# Altium schematic sheet FPGA_PWR.SchDoc
size A4; SheetNumber: 6; SheetTotal: 8
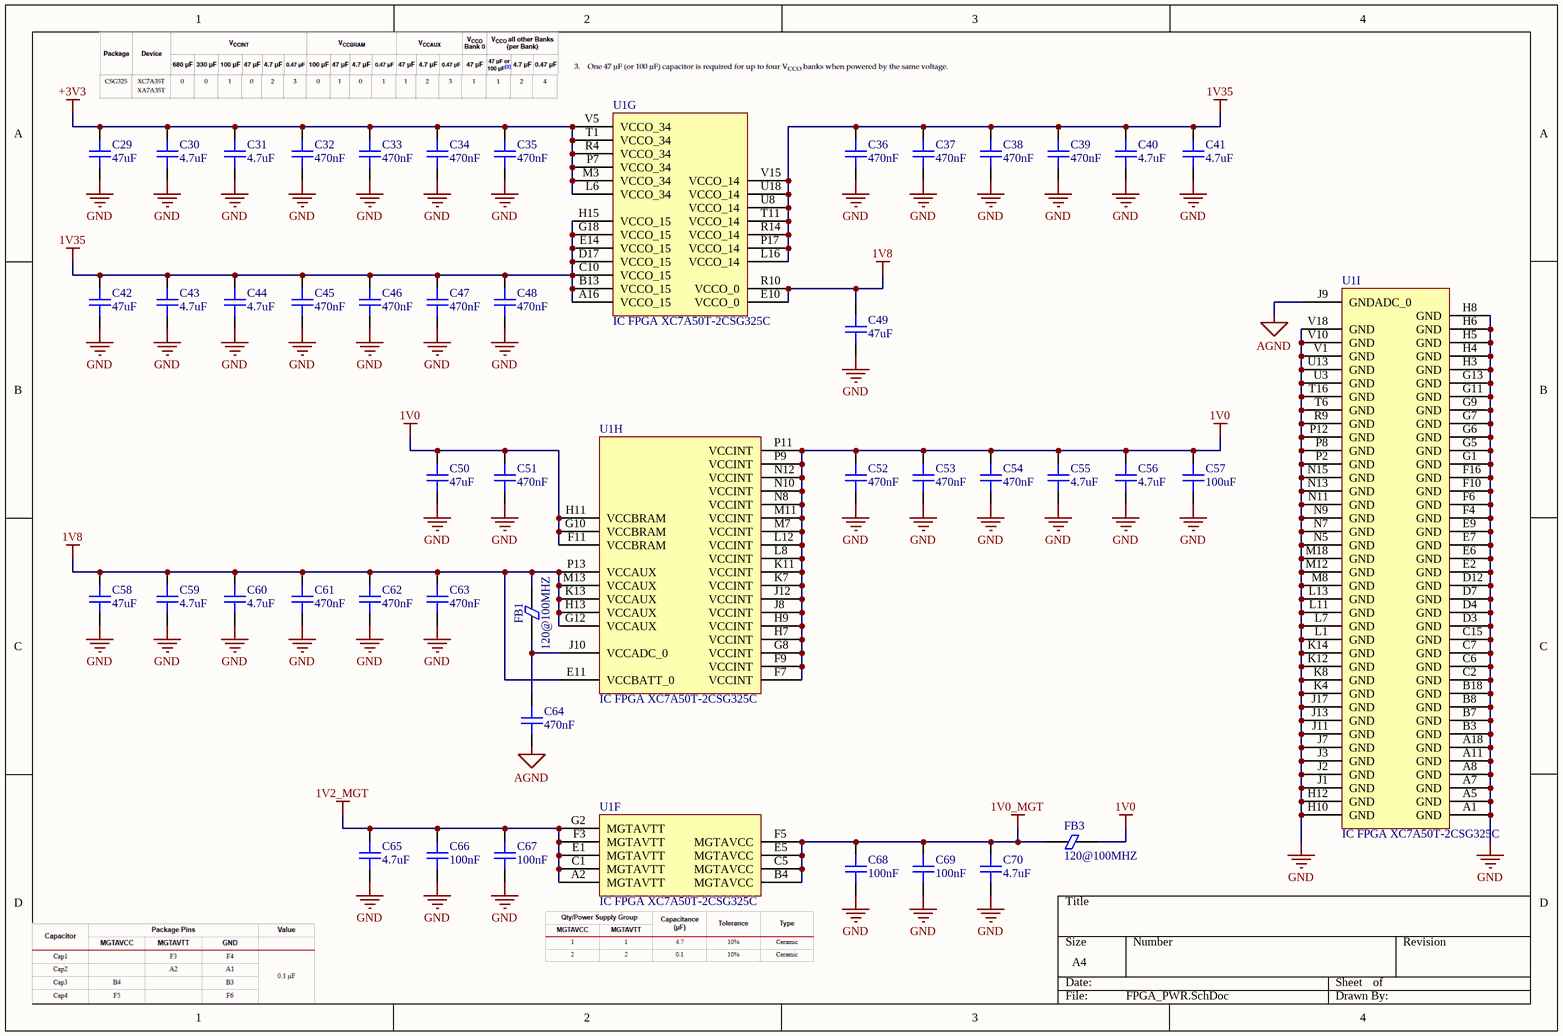
[diagram p0: FPGA_PWR.SchDoc]

## Parts
C29  47uF  [GEN_C_0805]
C30  4.7uF  [GEN_C_0402]
C31  4.7uF  [GEN_C_0402]
C32  470nF  [GEN_C_0201]
C33  470nF  [GEN_C_0201]
C34  470nF  [GEN_C_0201]
C35  470nF  [GEN_C_0201]
C36  470nF  [GEN_C_0201]
C37  470nF  [GEN_C_0201]
C38  470nF  [GEN_C_0201]
C39  470nF  [GEN_C_0201]
C40  4.7uF  [GEN_C_0402]
C41  4.7uF  [GEN_C_0402]
C42  47uF  [GEN_C_0805]
C43  4.7uF  [GEN_C_0402]
C44  4.7uF  [GEN_C_0402]
C45  470nF  [GEN_C_0201]
C46  470nF  [GEN_C_0201]
C47  470nF  [GEN_C_0201]
C48  470nF  [GEN_C_0201]
C49  47uF  [GEN_C_0805]
C50  47uF  [GEN_C_0805]
C51  470nF  [GEN_C_0201]
C52  470nF  [GEN_C_0201]
C53  470nF  [GEN_C_0201]
C54  470nF  [GEN_C_0201]
C55  4.7uF  [GEN_C_0402]
C56  4.7uF  [GEN_C_0402]
C57  100uF  [GEN_C_1210]
C58  47uF  [GEN_C_0805]
C59  4.7uF  [GEN_C_0402]
C60  4.7uF  [GEN_C_0402]
C61  470nF  [GEN_C_0201]
C62  470nF  [GEN_C_0201]
C63  470nF  [GEN_C_0201]
C64  470nF  [GEN_C_0201]
C65  4.7uF  [GEN_C_0402]
C66  100nF  [GEN_C_0201]
C67  100nF  [GEN_C_0201]
C68  100nF  [GEN_C_0201]
C69  100nF  [GEN_C_0201]
C70  4.7uF  [GEN_C_0402]
FB1  120@100MHZ  [GEN_R_0402]
FB3  120@100MHZ  [GEN_R_0402]
U1  IC FPGA XC7A50T-2CSG325C  [XILINX_XC7A50T-2CSG325C]  (parts F,G,H,I of 9)

## Nets
1V0: C50.2 C51.2 C52.2 C53.2 C54.2 C55.2 C56.2 C57.2 FB3.1 U1.F7(VCCINT) U1.F9(VCCINT) U1.F11(VCCBRAM) U1.G8(VCCINT) U1.G10(VCCBRAM) U1.H7(VCCINT) U1.H9(VCCINT) U1.H11(VCCBRAM) U1.J8(VCCINT) U1.J12(VCCINT) U1.K7(VCCINT) U1.K11(VCCINT) U1.L8(VCCINT) U1.L12(VCCINT) U1.M7(VCCINT) U1.M11(VCCINT) U1.N8(VCCINT) U1.N10(VCCINT) U1.N12(VCCINT) U1.P9(VCCINT) U1.P11(VCCINT)
1V0_MGT: C68.2 C69.2 C70.2 FB3.2 U1.B4(MGTAVCC) U1.C5(MGTAVCC) U1.E5(MGTAVCC) U1.F5(MGTAVCC)
1V2_MGT: C65.2 C66.2 C67.2 U1.A2(MGTAVTT) U1.C1(MGTAVTT) U1.E1(MGTAVTT) U1.F3(MGTAVTT) U1.G2(MGTAVTT)
1V8: C49.2 C58.2 C59.2 C60.2 C61.2 C62.2 C63.2 FB1.2 U1.E10(VCCO_0) U1.E11(VCCBATT_0) U1.G12(VCCAUX) U1.H13(VCCAUX) U1.K13(VCCAUX) U1.M13(VCCAUX) U1.P13(VCCAUX) U1.R10(VCCO_0)
1V35: C36.2 C37.2 C38.2 C39.2 C40.2 C41.2 C42.2 C43.2 C44.2 C45.2 C46.2 C47.2 C48.2 U1.A16(VCCO_15) U1.B13(VCCO_15) U1.C10(VCCO_15) U1.D17(VCCO_15) U1.E14(VCCO_15) U1.G18(VCCO_15) U1.H15(VCCO_15) U1.L16(VCCO_14) U1.P17(VCCO_14) U1.R14(VCCO_14) U1.T11(VCCO_14) U1.U8(VCCO_14) U1.U18(VCCO_14) U1.V15(VCCO_14)
+3V3: C29.2 C30.2 C31.2 C32.2 C33.2 C34.2 C35.2 U1.L6(VCCO_34) U1.M3(VCCO_34) U1.P7(VCCO_34) U1.R4(VCCO_34) U1.T1(VCCO_34) U1.V5(VCCO_34)
AGND: C64.1 U1.J9(GNDADC_0)
GND: C29.1 C30.1 C31.1 C32.1 C33.1 C34.1 C35.1 C36.1 C37.1 C38.1 C39.1 C40.1 C41.1 C42.1 C43.1 C44.1 C45.1 C46.1 C47.1 C48.1 C49.1 C50.1 C51.1 C52.1 C53.1 C54.1 C55.1 C56.1 C57.1 C58.1 C59.1 C60.1 C61.1 C62.1 C63.1 C65.1 C66.1 C67.1 C68.1 C69.1 C70.1 U1.A1(GND) U1.A5(GND) U1.A7(GND) U1.A8(GND) U1.A11(GND) U1.A18(GND) U1.B3(GND) U1.B7(GND) U1.B8(GND) U1.B18(GND) U1.C2(GND) U1.C6(GND) U1.C7(GND) U1.C15(GND) U1.D3(GND) U1.D4(GND) U1.D7(GND) U1.D12(GND) U1.E2(GND) U1.E6(GND) U1.E7(GND) U1.E9(GND) U1.F4(GND) U1.F6(GND) U1.F10(GND) U1.F16(GND) U1.G1(GND) U1.G5(GND) U1.G6(GND) U1.G7(GND) U1.G9(GND) U1.G11(GND) U1.G13(GND) U1.H3(GND) U1.H4(GND) U1.H5(GND) U1.H6(GND) U1.H8(GND) U1.H10(GND) U1.H12(GND) U1.J1(GND) U1.J2(GND) U1.J3(GND) U1.J7(GND) U1.J11(GND) U1.J13(GND) U1.J17(GND) U1.K4(GND) U1.K8(GND) U1.K12(GND) U1.K14(GND) U1.L1(GND) U1.L7(GND) U1.L11(GND) U1.L13(GND) U1.M8(GND) U1.M12(GND) U1.M18(GND) U1.N5(GND) U1.N7(GND) U1.N9(GND) U1.N11(GND) U1.N13(GND) U1.N15(GND) U1.P2(GND) U1.P8(GND) U1.P12(GND) U1.R9(GND) U1.T6(GND) U1.T16(GND) U1.U3(GND) U1.U13(GND) U1.V1(GND) U1.V10(GND) U1.V18(GND)
NetC64_2: C64.2 FB1.1 U1.J10(VCCADC_0)

## Library data of the parts
C29 C42 C49 C50 C58 = CAP 47uF 6.3V X5R 0805: House Part Number: C-47uF-0805-002; Manufacturer: Samsung; Manufacturer Part Number: CL21A476MQYNNNE; Voltage Rating: 6.3V; Package: 0805; Value: 47uF; Supplier 1: Digi-Key; Supplier Part Number 1: 1276-1852-1-ND
C30 C31 C40 C41 C43 C44 C55 C56 C59 C60 C65 C70 = CAP 4.7uF 6.3V X5R 0402: House Part Number: C-4.7uF-0402-002; Manufacturer: Murata; Manufacturer Part Number: GRM155R60J475ME47D; Voltage Rating: 6.3V; Package: 0402; Value: 4.7uF; Supplier 1: Digi-Key; Supplier Part Number 1: 490-5915-1-ND
C32-C39 C45-C48 C51-C54 C61-C64 = CAP 470nF 6.3V X5R 0201: House Part Number: C-470nF-0201-002; Manufacturer: Murata; Manufacturer Part Number: GRM033R60J474KE90D; Voltage Rating: 6.3V; Package: 0201; Value: 470nF; Supplier 1: Digi-Key; Supplier Part Number 1: 490-10409-1-ND
C57 = CAP 100uF 6.3V X5R 1210: House Part Number: C-100uF-1210-002; Manufacturer: Samsung; Manufacturer Part Number: CL32A107MQVNNNE; Voltage Rating: 6.3V; Package: 1210; Value: 100uF; Supplier 1: Digi-Key; Supplier Part Number 1: 1276-1092-1-ND
C66-C69 = CAP 100nF 6.3V X5R 0201: House Part Number: C-100nF-0201-002; Manufacturer: Murata; Manufacturer Part Number: GRM033R60J104KE19D; Voltage Rating: 6.3V; Package: 0201; Supplier 1: Digi-Key; Supplier Part Number 1: 490-3167-1-ND; Value: 100nF
FB1 FB3 = FERRITE BEAD 120 OHM 0402: House Part Number: BLM15PX121SN1D; Manufacturer: Murata; Supplier 1: Digi-Key; Supplier Part Number 1: 490-9656-1-ND; Manufacturer Part Number: BLM15PX121SN1D
U1 = IC FPGA XC7A50T-2CSG325C: Artix-7 FPGA, 150 User I/Os, 4 GTP, 324-Ball BGA, Speed Grade 2, Commercial Grade, Pb-Free; Manufacturer: Xilinx; House Part Number: XC7A50T-2CSG325C; Manufacturer Part Number: XC7A50T-2CSG325C; Supplier 1: Digi-Key; Supplier Part Number 1: 122-2193-ND